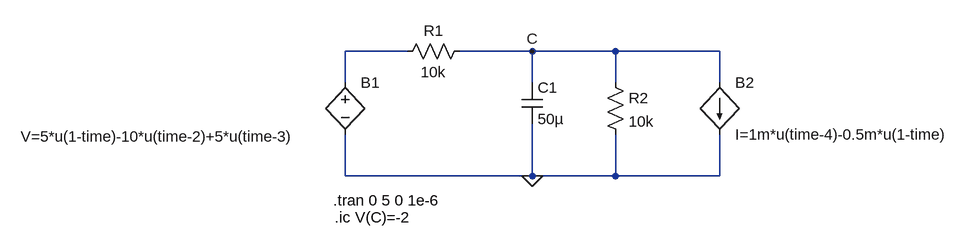
[diagram p0: schematic 10.3.asc]
10.3.asc, the LTspice schematic file:
Version 4
SHEET 1 1044 680
WIRE 112 32 16 32
WIRE 304 32 192 32
WIRE 432 32 304 32
WIRE 592 32 432 32
WIRE 16 80 16 32
WIRE 304 80 304 32
WIRE 432 80 432 32
WIRE 592 80 592 32
WIRE 16 224 16 160
WIRE 304 224 304 144
WIRE 304 224 16 224
WIRE 432 224 432 160
WIRE 432 224 304 224
WIRE 592 224 592 160
WIRE 592 224 432 224
FLAG 304 224 0
FLAG 304 32 C
SYMBOL bv 16 64 R0
WINDOW 3 -499 99 Left 2
SYMATTR InstName B1
SYMATTR Value V=5*u(1-time)-10*u(time-2)+5*u(time-3)
SYMBOL res 96 48 R270
WINDOW 0 32 56 VTop 2
WINDOW 3 0 56 VBottom 2
SYMATTR InstName R1
SYMATTR Value 10k
SYMBOL cap 288 80 R0
SYMATTR InstName C1
SYMATTR Value 50µ
SYMBOL res 416 64 R0
SYMATTR InstName R2
SYMATTR Value 10k
SYMBOL bi 592 80 R0
SYMATTR InstName B2
SYMATTR Value I=1m*u(time-4)-0.5m*u(1-time)
TEXT -2 262 Left 2 !.tran 0 5 0 1e-6
TEXT 0 288 Left 2 !.ic V(C)=-2

The netlist it stands for:
* 10.3.asc
B1 N001 0 V=5*u(1-time)-10*u(time-2)+5*u(time-3)
R1 N001 C 10k
C1 C 0 50µ
R2 C 0 10k
B2 C 0 I=1m*u(time-4)-0.5m*u(1-time)
.tran 0 5 0 1e-6
.ic V(C)=-2
.backanno
.end